# EAGLE schematic xmas_v4 (EAGLE 8.2.0)
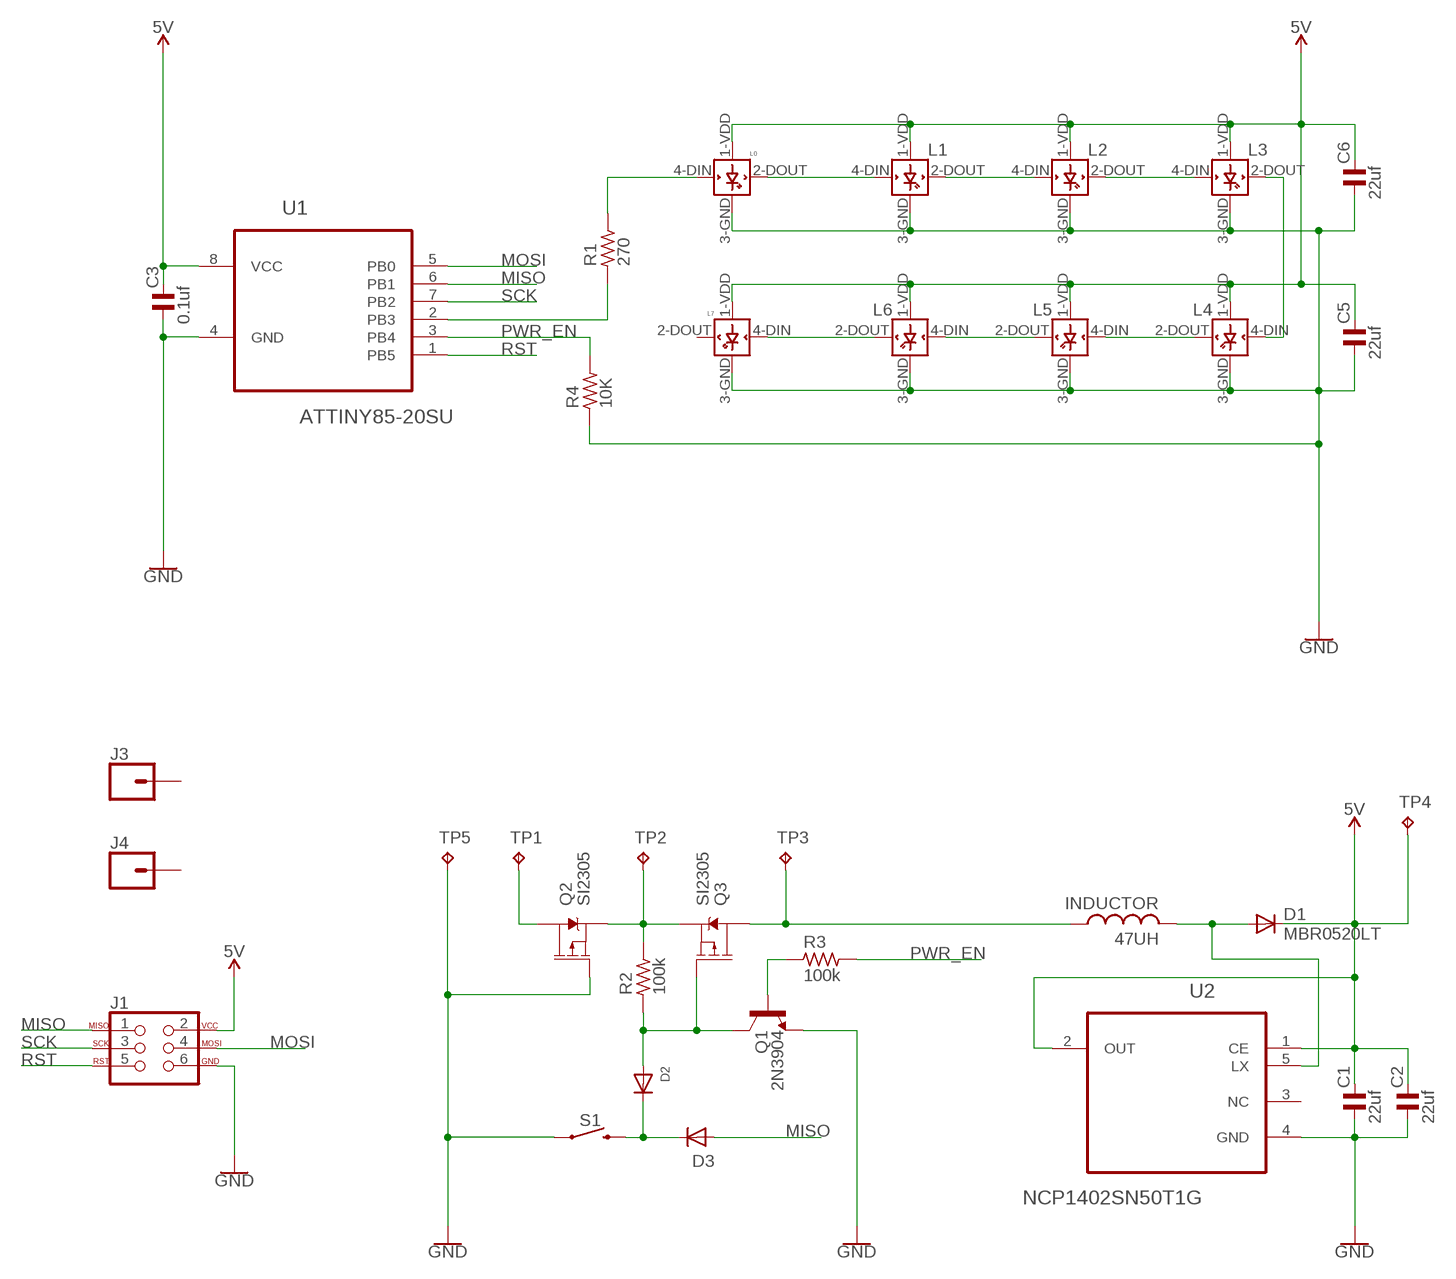
[diagram p0: schematic, sheet 1]

## Parts
47UH  INDUCTOR  [CD32]
C1  22uf  C_0805MP  [C0805MP]
C2  22uf  C_0805MP  [C0805MP]
C3  0.1uf  C_0603MP  [C0603MP]
C5  22uf  C_0805MP  [C0805MP]
C6  22uf  C_0805MP  [C0805MP]
D1  MBR0520LT  [SOD123]
D2  DIODESOD-123  [SOD-123]
D3  DIODESOD-123  [SOD-123]
J1  AVR_SPI_PROG_3X2TESTPOINTS  [2X3_TEST_POINTS]
J3  CONN_01PTH_NO_SILK_KIT  [1X01NS_KIT]
J4  CONN_01PTH_NO_SILK_KIT  [1X01NS_KIT]
L0  WS2812B  [WS2812B]
L1  WS2812B  [WS2812B]
L2  WS2812B  [WS2812B]
L3  WS2812B  [WS2812B]
L4  WS2812B  [WS2812B]
L5  WS2812B  [WS2812B]
L6  WS2812B  [WS2812B]
L7  WS2812B  [WS2812B]
Q1  2N3904  TRANS_NPN-MMBT2222AL  [SOT23-3]
Q2  SI2305  MOSFET_PCH-SI2309DS  [SOT23-3]
Q3  SI2305  MOSFET_PCH-SI2309DS  [SOT23-3]
R1  270  R_0603MP  [R0603MP]
R2  100k  R_0603MP  [R0603MP]
R3  100k  R_0603MP  [R0603MP]
R4  10K  R_0805MP  [R0805MP]
S1  MOMENTARY-SWITCH-SPST-SMD-6.2MM-TALL  [TACTILE_SWITCH_SMD_6.2MM_TALL]
TP1  TPB1,27  [B1,27]
TP2  TPB1,27  [B1,27]
TP3  TPB1,27  [B1,27]
TP4  TPB1,27  [B1,27]
TP5  TPB1,27  [B1,27]
U1  ATTINY85-20SU  [SOIC127P798X216-8N]
U2  NCP1402SN50T1G  [SOT95P275X110-5N]

## Nets
5V: C1.2 C2.2 C3.2 C5.2 C6.2 D1.C J1.2 L0.1-VDD(VDD) L1.1-VDD(VDD) L2.1-VDD(VDD) L3.1-VDD(VDD) L4.1-VDD(VDD) L5.1-VDD(VDD) L6.1-VDD(VDD) L7.1-VDD(VDD) TP4.TP U1.8(VCC) U2.1(CE) U2.2(OUT)
GND: C1.1 C2.1 C3.1 C5.1 C6.1 J1.6 L0.3-GND(GND) L1.3-GND(GND) L2.3-GND(GND) L3.3-GND(GND) L4.3-GND(GND) L5.3-GND(GND) L6.3-GND(GND) L7.3-GND(GND) Q1.2(E) Q2.1(G) R4.1 S1.A2 TP5.TP U1.4(GND) U2.4(GND)
MISO: D3.A J1.1 U1.6(PB1)
MOSI: J1.4 U1.5(PB0)
N$1: Q2.3(D) TP1.TP
N$2: Q2.2(S) Q3.2(S) R2.2 TP2.TP
N$3: D2.A Q1.3(C) Q3.1(G) R2.1
N$4: 47UH.1 Q3.3(D) TP3.TP
N$5: D2.C D3.C S1.B2
N$6: L0.2-DOUT(DOUT) L1.4-DIN(DIN)
N$7: Q1.1(B) R3.1
N$8: 47UH.2 D1.A U2.5(LX)
N$9: L1.2-DOUT(DOUT) L2.4-DIN(DIN)
N$10: L2.2-DOUT(DOUT) L3.4-DIN(DIN)
N$11: L3.2-DOUT(DOUT) L4.4-DIN(DIN)
N$12: L6.2-DOUT(DOUT) L7.4-DIN(DIN)
N$13: L5.2-DOUT(DOUT) L6.4-DIN(DIN)
N$14: L4.2-DOUT(DOUT) L5.4-DIN(DIN)
N$19: R1.1 U1.2(PB3)
N$20: L0.4-DIN(DIN) R1.2
PWR_EN: R3.2 R4.2 U1.3(PB4)
RST: J1.5 U1.1(PB5)
SCK: J1.3 U1.7(PB2)
Unconnected: J3.1 J4.1 L7.2-DOUT(DOUT) U2.3(NC)

## Library data of the parts
47UH = hybridair:INDUCTOR
C1-C3 C5 C6 = rc-master-smd:C_: NON-POLARIZED CAP
D1 = diode:MBR0520LT: SCHOTTKY BARRIER RECTIFIER Source: http://onsemi.com .. MBR0520LT1-D.pdf
D2 D3 = adafruit:DIODE: Diode SMADIODE - SMA Surface Mount Package 20V 1A Schottky Diode Digikey: 641-1014-6-ND DO-1N4148 - Through Hole Small Current Diode SOD-123 20V 1 A (.5mV Vf) Schottky Diode - Digikey: MBRX120TPMSCT-ND SOD-323 10V 570mA (.38mV Vf, 3ns) Schottky Diode - Digikey: ZLLS410CT-ND SOD-523 30V 30mA Schottky Diode (RB751S-40TE61) - Digikey: RB751S-40TE61CT-ND SOT23-R/W - SOT23 Package (R = Solder Paste/Reflow Ovens, W = Hand-Soldering) BAT54Film 40V 300mA - Digikey: 497-7162-1-ND
J1 = SparkFun-Connectors:AVR_SPI_PROG_3X2: AVR ISP 6 Pin This is the reduced ISP connector for AVR programming. Common on Arduino. This footprint will take up less PCB space and can be used with a 10-pin to 6-pin adapter such as SKU: BOB-08508 **Special note about "TEST_POINT" package. The stop mask is on the top side, so if you want your programming test points to be on the bottom of your board, make sure to place this package on the bottom side of the board. This also ensure that the orientation to program from the bottom side will be correct. SparkFun Products: SparkFun ISP Pogo Adapter <https://www.sparkfun.com/products/11591> - NS Tiny AVR Programmer <https://www.sparkfun.com/products/11801> -PTH
J3 J4 = SparkFun-Connectors:CONN_01: Single connection point. Often used as Generic Header-pin footprint for 0.1 inch spaced/style header connections On any of the 0.1 inch spaced packages, you can populate with these: Break Away Headers - Straight <https://www.sparkfun.com/products/116> (PRT-00116) Break Away Male Headers - Right Angle <https://www.sparkfun.com/products/553> (PRT-00553) Female Headers <https://www.sparkfun.com/products/115> (PRT-00115) Break Away Headers - Machine Pin <https://www.sparkfun.com/products/117> (PRT-00117) Break Away Female Headers - Swiss Machine Pin <https://www.sparkfun.com/products/743> (PRT-00743) This device is also useful as a general connection point to wire up your design to another part of your project. Our various solder wires solder well into these plated through hole pads. Hook-Up Wire - Assortment (Stranded, 22 AWG) <https://www.sparkfun.com/products/11375> (PRT-11375) Hook-Up Wire - Assortment (Solid Core, 22 AWG) <https://www.sparkfun.com/products/11367> (PRT-11367) View the entire wire category on our website here <https://www.sparkfun.com/categories/141> Special notes: SMTSO-256-ET is a "flush mount" nut for a 4-40 screw. We mostly use this on specialty testbeds; it is a nice way to connect hardware to your PCB at an adjustable hieght. Also note, the SNAP packages are for using a snappable style connector. We sell a baggie of snaps and they are also used on two LilyPad designs: Snap Assortment - 30 pack (male and female) <https://www.sparkfun.com/products/11347> (DEV-11347) LilyPad Arduino SimpleSnap <https://www.sparkfun.com/products/10941> (DEV-10941) LilyPad SimpleSnap Protoboard <https://www.sparkfun.com/products/10940> (DEV-10940)
L0 L1-L7 = xmas_v4lib:WS2812B
Q1 = SparkFun-DiscreteSemi:TRANS_NPN: NPN transistor Current controlled devices typically used to amplify current or used as a switch. BC547 - COM-08928 <http://www.sparkfun.com/products/8928> (TO-92 45V 100mA) (1.Collector 2.Base 3.Emitter) 2N3904 - COM-00521 <http://www.sparkfun.com/products/521> (TO-92 40V 200mA) (1.Emitter 2.Base 3.Collector) P2N2222A - COM-12852 <http://www.sparkfun.com/products/12852> (TO-92 40V 600mA) (1.Collector 2.Base 3.Emitter); PROD_ID: TRANS-08049; VALUE: 600mA/40V
Q2 Q3 = SparkFun-DiscreteSemi:MOSFET_PCH: P-channel MOSFETs Voltage controlled devices that allow control of high current outputs. SparkFun Products: SparkFun ESP32 Thing <https://www.sparkfun.com/products/13907> SparkFun ESP8266 Thing <https://www.sparkfun.com/products/13231>; PROD_ID: TRANS-08285; VALUE: 1.1A/60V/600mΩ
R1-R4 = rc-master-smd:R_: RESISTOR
S1 = xmas_v4lib:MOMENTARY-SWITCH-SPST: Momentary Switch (Pushbutton) - SPST Normally-open (NO) SPST momentary switches (buttons, pushbuttons). Variants PTH-12MM - 12mm square, through-hole Momentary Pushbutton Switch - 12mm Square <https://www.sparkfun.com/products/9190> (COM-09190) PTH-6.0MM, PTH-6.0MM-KIT - 6.0mm square, through-hole Mini Pushbutton Switch <https://www.sparkfun.com/products/97> (COM-00097) KIT package intended for soldering kit's - only one side of pads' copper is exposed. PTH-RIGHT-ANGLE-KIT - Right-angle, through-hole Right Angle Tactile Button <https://www.sparkfun.com/products/10791> - Used on SparkFun BigTime Watch Kit <https://www.sparkfun.com/products/11734> SMD-12MM - 12mm square, surface-mount Tactile Button - SMD (12mm) <https://www.sparkfun.com/products/12993> (COM-12993) Used on SparkFun PicoBoard <https://www.sparkfun.com/products/11888> SMD-4.5MM - 4.5mm Square Trackball Switch Used on SparkFun Blackberry Trackballer Breakout <https://www.sparkfun.com/products/13169> SMD-4.6MMX2.8MM - 4.60mm x 2.80mm, surface mount Used on SparkFun SAMD21 Mini Breakout <https://www.sparkfun.com/products/13664> SMD-5.2MM, SMD-5.2-REDUNDANT - 5.2mm square, surface-mount Mini Pushbutton Switch - SMD <https://www.sparkfun.com/products/8720> (COM-08720) Used on Arduino Pro Mini <https://www.sparkfun.com/products/11114> REDUNDANT package connects both switch circuits together SMD-6.0X3.5MM - 6.0 x 3.5mm, surface mount Momentary Reset Switch SMD <https://www.sparkfun.com/products/8229> (COM-08229) SMD-6.2MM-TALL - 6.2mm square, surface mount Tactile Button - SMD (6mm) <https://www.sparkfun.com/products/12992> Used on SparkFun Digital Sandbox <https://www.sparkfun.com/products/12651> SMD-RIGHT-ANGLE - Right-angle, surface mount Used on SparkFun Block for Intel® Edison - Arduino <https://www.sparkfun.com/products/13036>; PROD_ID: SWCH-11966; SF_SKU: COM-12992
TP1-TP5 = testpad:TP: Test pad
U1 = Atmel_By_element14_Batch_1-00:ATTINY85-20SU: 8-bit Microcontroller with In-System Programmable Flash; MPN: ATTINY85-20SU; OC_FARNELL: 1455164; OC_NEWARK: 58M3797; PACKAGE: SOIC-8; SUPPLIER: Atmel
U2 = hybridair:NCP1402SN50T1G: 200 mA, PFM Step-Up Micropower Switching Regulator; MPN: NCP1402SN50T1G; OC_FARNELL: 1652393; OC_NEWARK: 98H0882; PACKAGE: SOT-23-5; SUPPLIER: ON SEMICONDUCTOR